# EAGLE design NodeLight (EAGLE 8.5.2)
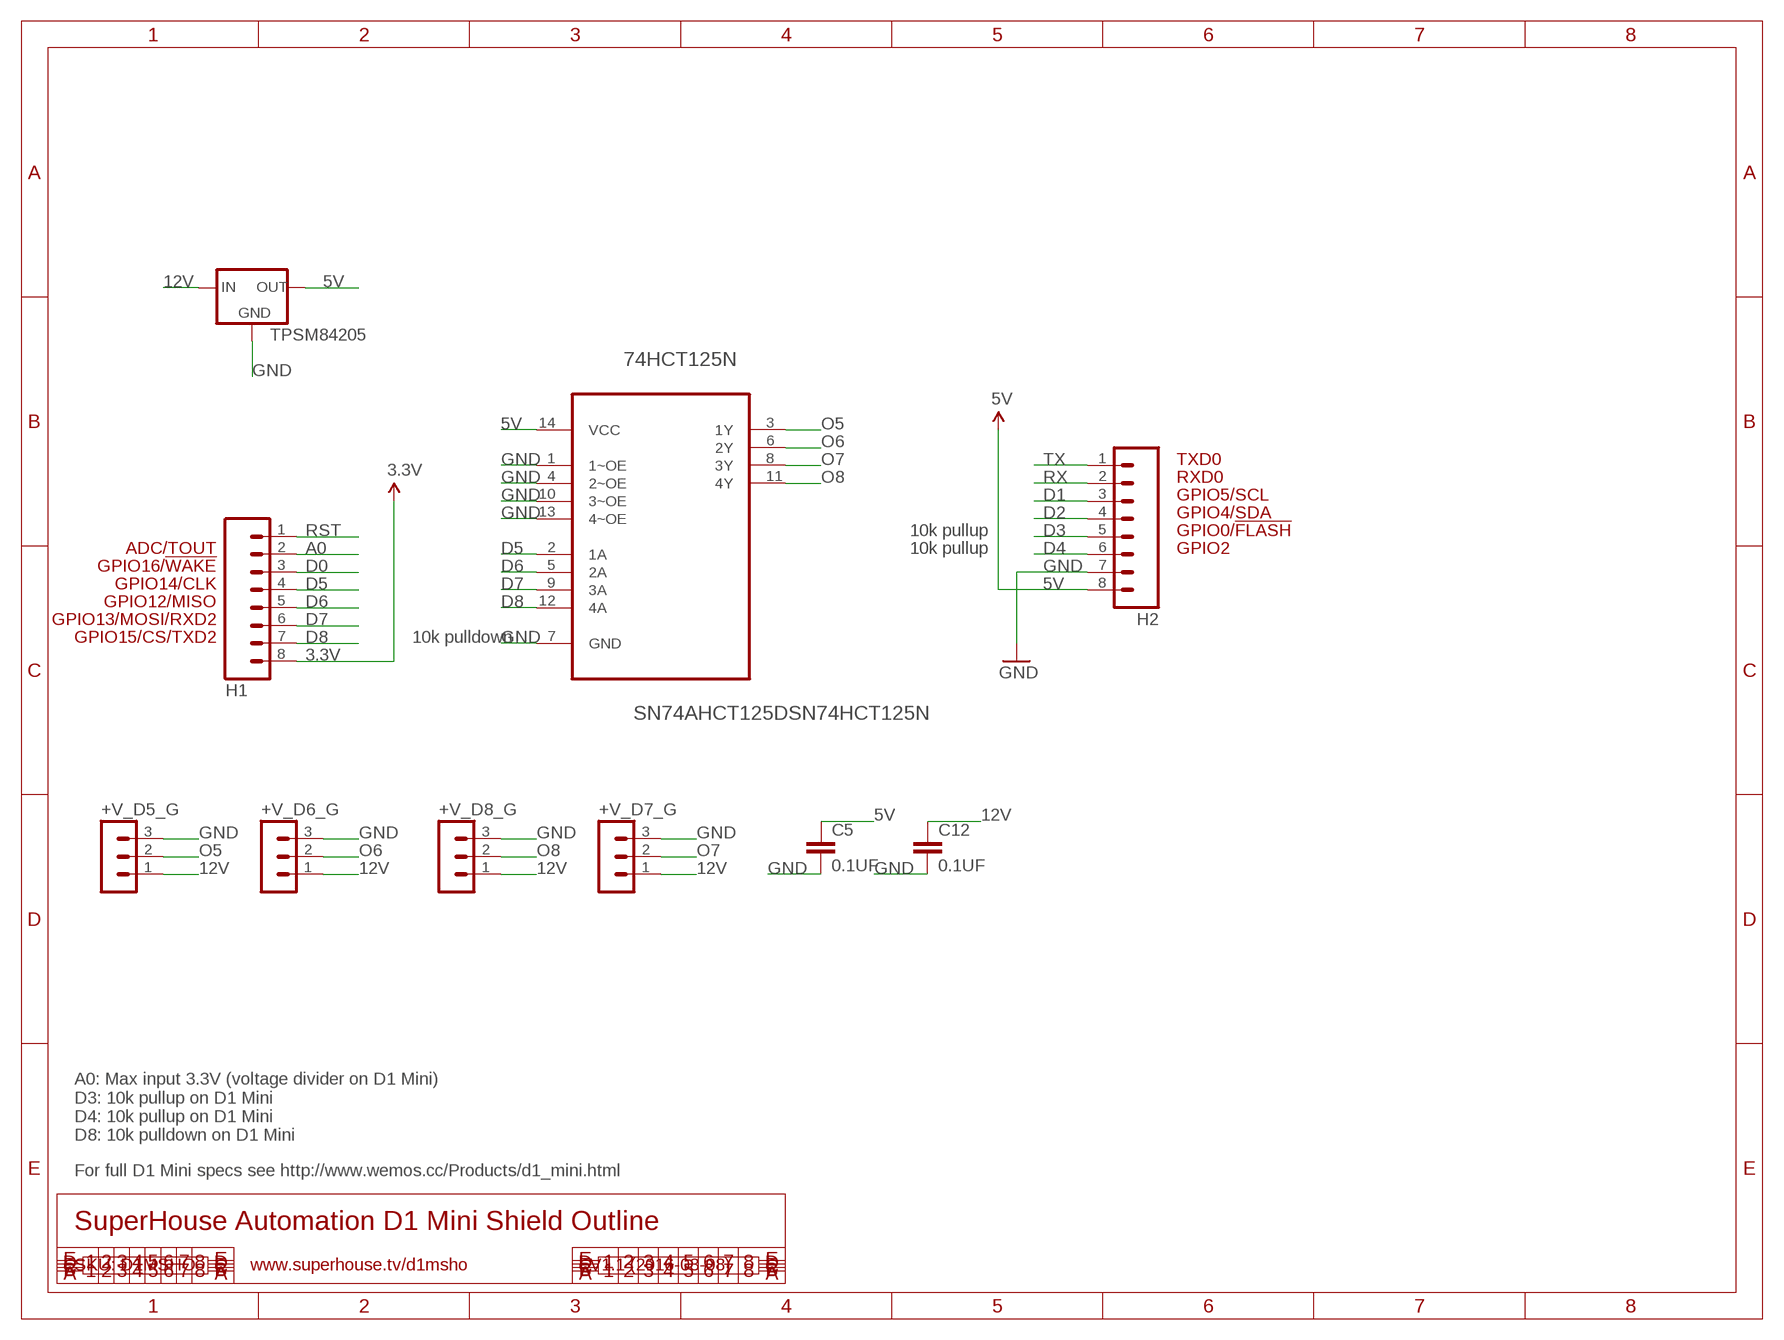
[diagram p0: schematic, sheet 1]

## Parts
74HCT125N  SN74AHCT125DSN74HCT125N  [DIP254P762X508-14]
+V_D5_G  MA03-1  [MA03-1]
+V_D6_G  MA03-1  [MA03-1]
+V_D7_G  MA03-1  [MA03-1]
+V_D8_G  MA03-1  [MA03-1]
C5  0.1UF  C-EU025-025X050  [C025-025X050]
C12  0.1UF  C-EU025-025X050  [C025-025X050]
H1  M08  [1X08]
H2  M08  [1X08]
TPSM84205  78MXXS  [78MXXS]

## Nets
3.3V: H1.8
5V: 74HCT125N.14(VCC) C5.1 H2.8 TPSM84205.OUT
12V: +V_D5_G.1 +V_D6_G.1 +V_D7_G.1 +V_D8_G.1 C12.1 TPSM84205.IN
A0: H1.2
D0: H1.3
D1: H2.3
D2: H2.4
D3: H2.5
D4: H2.6
D5: 74HCT125N.2(1A) H1.4
D6: 74HCT125N.5(2A) H1.5
D7: 74HCT125N.9(3A) H1.6
D8: 74HCT125N.12(4A) H1.7
GND: 74HCT125N.1(1~OE) 74HCT125N.4(2~OE) 74HCT125N.7(GND) 74HCT125N.10(3~OE) 74HCT125N.13(4~OE) +V_D5_G.3 +V_D6_G.3 +V_D7_G.3 +V_D8_G.3 C5.2 C12.2 H2.7 TPSM84205.GND
O5: 74HCT125N.3(1Y) +V_D5_G.2
O6: 74HCT125N.6(2Y) +V_D6_G.2
O7: 74HCT125N.8(3Y) +V_D7_G.2
O8: 74HCT125N.11(4Y) +V_D8_G.2
RST: H1.1
RX: H2.2
TX: H2.1

## Notes on the sheet
- TXD0
- RXD0
- GPIO5/SCL
- GPIO4/SDA
- 10k pullup | GPIO0/!FLASH
- ADC/TOUT | 10k pullup | GPIO2
- GPIO16/!WAKE
- GPIO14/CLK
- GPIO12/MISO
- GPIO13/MOSI/RXD2
- GPIO15/CS/TXD2 | 10k pulldown
- A0: Max input 3.3V (voltage divider on D1 Mini)
  D3: 10k pullup on D1 Mini
  D4: 10k pullup on D1 Mini
  D8: 10k pulldown on D1 Mini
- For full D1 Mini specs see http://www.wemos.cc/Products/d1_mini.html
- SuperHouse Automation D1 Mini Shield Outline
- SKU: D1MSHO | www.superhouse.tv/d1msho | V1.1 (2016-03-08)

## Library data of the parts
74HCT125N = parts:SN74AHCT125D: QUADRUPLE BUS BUFFER GATES WITH 3-STATE OUTPUTS
+V_D5_G +V_D6_G +V_D7_G +V_D8_G = con-lstb:MA03-1: PIN HEADER; OC_FARNELL: unknown; OC_NEWARK: unknown
C5 C12 = rcl:C-EU: CAPACITOR, European symbol; SPICEPREFIX: C
H1 H2 = freetronics-original:M08: Header 8 Standard 8-pin 0.1" header. Use with straight break away headers (SKU : PRT-00116), right angle break away headers (PRT-00553), swiss pins (PRT-00743), machine pins (PRT-00117), and female headers (PRT-00115).
TPSM84205 = v-reg:78MXXS: VOLTAGE REGULATOR

## Net classes
0 default: width 0.203 mm, drill 0.356 mm, clearance 0.152 mm
1 power: width 0.203 mm, clearance 0.152 mm

## Board
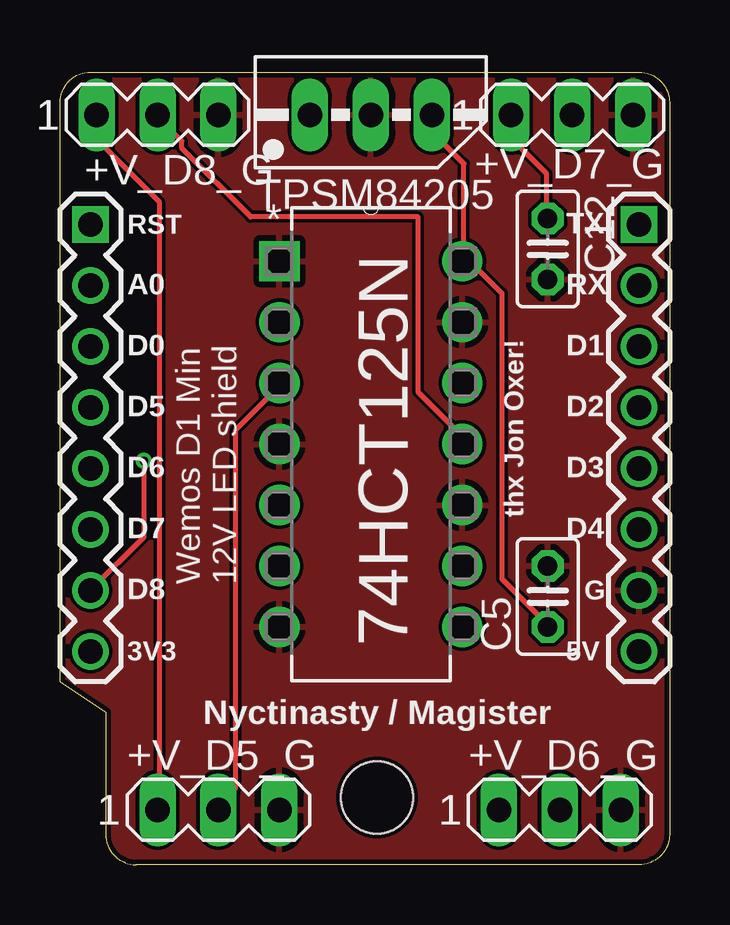
[diagram p1: board, top side]
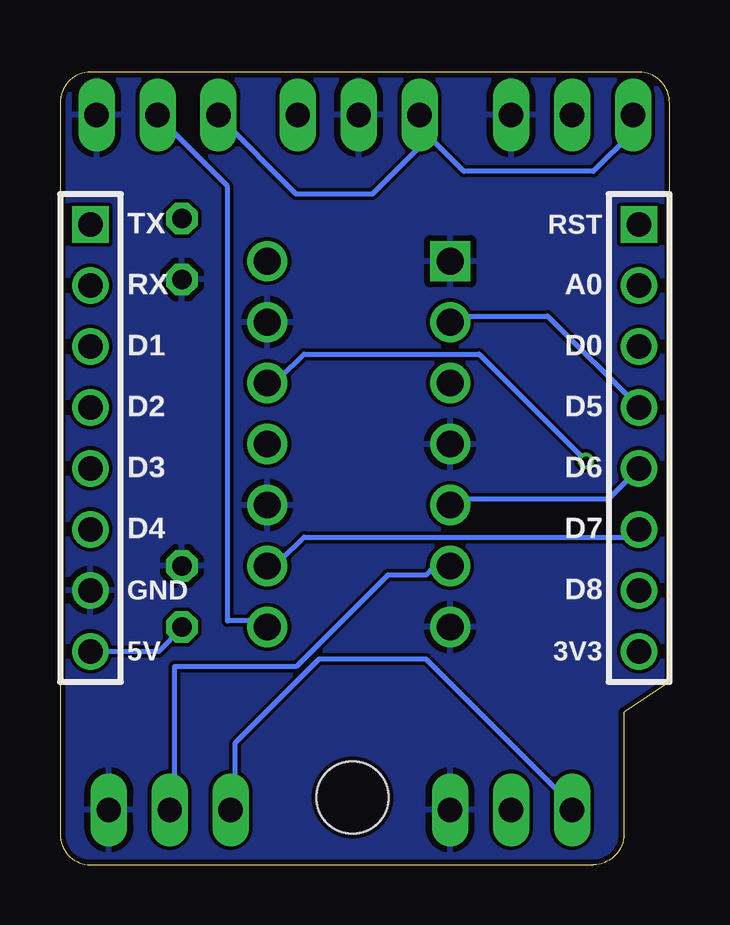
[diagram p2: board, bottom side, seen from below]

Size 25.4 x 33.02 mm. Coordinates in mm from the lower left corner, seen from the top.
Outline: 25.4,31.75 25.4,1.27 arc-90 24.13,0 3.17,0 arc-90 1.91,1.27 1.91,6.35 0,7.62 0,31.75 arc-90 1.27,33.02 24.13,33.02 arc-90 25.4,31.75
Copper layers (1*16): Top 0.035mm / dielectric 1.5mm / Bottom 0.035mm
Design rules "ElectroDragon_2layer_DRU_no_angle_20140221": minimum track width 6mil, minimum drill 12mil, track to track 6mil, track to pad 6mil, pad to pad 6mil, via to via 6mil, smd to smd 6mil, copper to edge 8mil, drill to drill 6mil, minimum pad ring 10mil, minimum via ring 6mil, stop-mask expansion 4mil, vias tented up to drill 100mil, thermal gap 10mil
Holes 3 mm at 13.21,2.79

### Footprints (pad centres in the part's own frame; a part is rotated, then mirrored left to right if it is on the bottom)
DIP254P762X508-14 = drill 1.118 square: 1 -7.62,15.24 | drill 1.118: 2 -7.62,12.7; 3 -7.62,10.16; 4 -7.62,7.62; 5 -7.62,5.08; 6 -7.62,2.54; 7 -7.62,0; 8 0,0; 9 0,2.54; 10 0,5.08; 11 0,7.62; 12 0,10.16; 13 0,12.7; 14 0,15.24
MA03-1 = drill 1.016 long: 1 -2.54,0; 2 0,0; 3 2.54,0
C025-025X050 = drill 0.813 octagon: 1 -1.27,0; 2 1.27,0
1X08 = drill 1.016 square: 1 0,0 | drill 1.016: 2 2.54,0; 3 5.08,0; 4 7.62,0; 5 10.16,0; 6 12.7,0; 7 15.24,0; 8 17.78,0
78MXXS = drill 1.016 long: GND 0,-2.54; IN -2.54,-2.54; OUT 2.54,-2.54

### Placement (x,y rotation side)
74HCT125N  16.76,9.91 0 top
+V_D5_G  6.6,2.29 0 top
+V_D6_G  20.83,2.29 0 top
+V_D7_G  21.34,31.24 0 top
+V_D8_G  4.06,31.24 0 top
C5  20.32,11.18 90 top
C12  20.32,25.65 270 top
H1  1.27,26.67 270 top
H2  24.13,26.67 270 top
TPSM84205  12.95,33.78 0 top

### Tracks (layer width: path | path; a pad name or v marks a point on that pad's centre or on a via)
5V
  Top 0.203: 16.83,25.4 18.41,23.81 18.41,11.91 20.32,10 C5.1 20.45,9.96 | 16.83,25.4 16.83,29.21 15.56,30.48 TPSM84205.OUT | 16.83,25.4 74HCT125N.14
  Bottom 0.203: H2.8 21.27,8.89 20.32,9.84 C5.1
12V
  Top 0.203: +V_D5_G.1 4.13,2.54 4.13,27.62 1.59,30.16 1.59,31.11 +V_D8_G.1 | C12.1 20.27,27.03 20.27,28.8 18.85,30.23 18.85,31.11 +V_D7_G.1
  Bottom 0.203: +V_D5_G.1 4.13,2.54 10.16,8.57 14.61,8.57 18.1,5.08 18.1,2.54 +V_D6_G.1 | 9.84,30.16 8.57,28.89 3.17,28.89 1.59,30.48 1.59,31.11 +V_D8_G.1 | 9.84,30.16 10.16,30.48 TPSM84205.IN 9.84,30.16 | 9.84,30.16 10.16,30.16 12.38,27.94 15.56,27.94 18.73,31.11 +V_D7_G.1
D5
  Bottom 0.203: H1.4 5.08,22.86 8.89,22.86 74HCT125N.2
D6
  Bottom 0.203: H1.5 2.54,15.24 8.89,15.24 74HCT125N.5
D7
  Bottom 0.203: H1.6 1.59,13.65 15.24,13.65 16.19,12.7 16.51,12.7 74HCT125N.9
D8  (via drill 0.36)
  Top 0.203: H1.7 3.49,13.65 v3.49,16.83
  Bottom 0.203: v3.49,16.83 7.94,21.27 15.24,21.27 16.19,20.32 16.51,20.32 74HCT125N.12
GND
  pour Top: 25.4,31.75 arc90 24.13,33.02 1.27,33.02 arc90 0,31.75 0,7.62 1.91,6.35 1.91,1.27 arc90 3.17,0 24.13,0 arc90 25.4,1.27
  pour Bottom: 25.4,1.27 25.4,31.75 arc90 24.13,33.02 1.27,33.02 arc90 0,31.75 0,7.62 1.91,6.35 1.91,1.27 arc90 3.17,0 24.13,0 arc90
O5
  Top 0.203: +V_D5_G.2 6.67,2.54 7.3,3.17 7.3,18.1 8.89,19.68 8.89,20 74HCT125N.3
O6
  Bottom 0.203: +V_D6_G.2 20.64,2.54 20.64,8.26 15.56,8.26 11.75,12.06 10.16,12.06 9.84,12.38 9.21,12.38 74HCT125N.6
O7
  Bottom 0.203: +V_D7_G.2 21.27,31.11 18.41,28.26 18.41,10.16 16.83,10.16 74HCT125N.8
O8
  Top 0.203: +V_D8_G.2 4.13,31.11 5.08,30.16 5.08,29.84 7.94,26.99 14.92,26.99 14.92,19.68 16.51,18.1 16.51,17.78 74HCT125N.11

### Text on the board
tPlace: RST | TX | A0 | RX | D0 | D1 | D5 | D2 | D6 | D3 | D7 | thx Jon Oxer! | D4 | Wemos D1 Min / 12V LED shield | D8 | G | 3V3 | 5V | Nyctinasty / Magister
bPlace: RST | TX | A0 | RX | D0 | D1 | D5 | D2 | D6 | D3 | D7 | D4 | D8 | GND | 3V3 | 5V